# Altium schematic sheet Flyback Transformer.SchDoc
size A; SheetNumber: 6; SheetTotal: 9
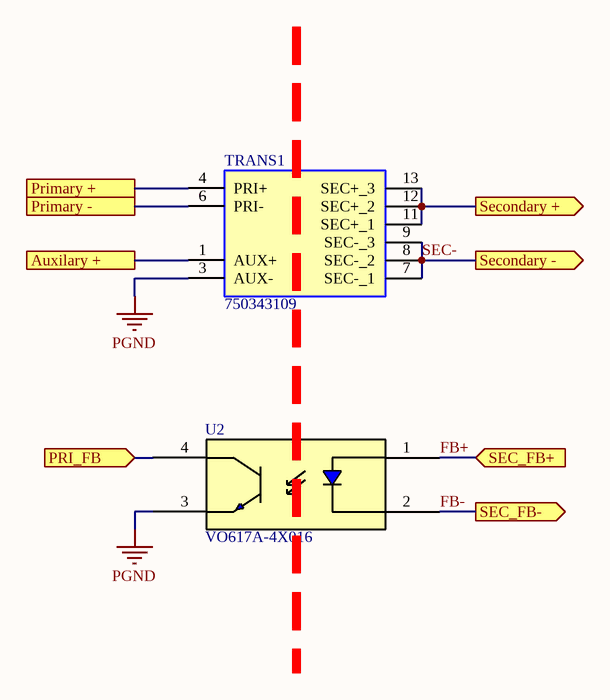
[diagram p0: Flyback Transformer.SchDoc]

## Parts
TRANS1  750343109  [750343109]
U2  VO617A-4X016  [VO617A-4X016]

## Ports
Auxilary +, PRI_FB (in), Primary +, Primary -, SEC_FB+ (in), SEC_FB- (out), Secondary + (out), Secondary - (out)

## Nets
PGND: TRANS1.3(AUX-) U2.3(E)
Auxilary +: TRANS1.1(AUX+) ; port Auxilary +
FB+: U2.1(A) ; port SEC_FB+
FB-: U2.2(C) ; port SEC_FB-
PRI_FB: U2.4(C) ; port PRI_FB
Primary +: TRANS1.4(PRI+) ; port Primary +
Primary -: TRANS1.6(PRI-) ; port Primary -
SEC-: TRANS1.7(SEC-_1) TRANS1.8(SEC-_2) TRANS1.9(SEC-_3) ; port Secondary -
Secondary +: TRANS1.11(SEC+_1) TRANS1.12(SEC+_2) TRANS1.13(SEC+_3) ; port Secondary +

## Library data of the parts
TRANS1 = 750343109: Power Transformers WE-FB SMD Flyback Dialog Semi iW1830; Supplier 1: Mouser; Supplier Part Number 1: 710-750343109
U2 = VO617A-4X016: Transistor Output Optocouplers RECOMMENDED ALT 782-SFH617A-4X016; Supplier 1: Mouser; Supplier Part Number 1: 78-VO617A-4X016